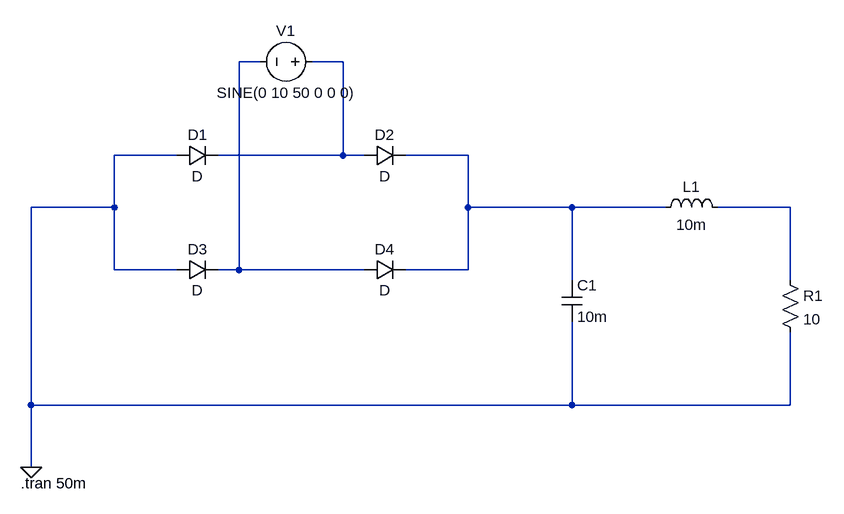
[diagram p0: schematic rectifier_circuit_v2.asc]
rectifier_circuit_v2.asc, the LTspice schematic file:
Version 4.1
SHEET 1 984 680
WIRE 112 -48 80 -48
WIRE 240 -48 192 -48
WIRE -16 96 -112 96
WIRE 240 96 240 -48
WIRE 240 96 48 96
WIRE 272 96 240 96
WIRE 432 96 336 96
WIRE -112 176 -112 96
WIRE -112 176 -240 176
WIRE 432 176 432 96
WIRE 592 176 432 176
WIRE 736 176 592 176
WIRE 928 176 816 176
WIRE -112 272 -112 176
WIRE -16 272 -112 272
WIRE 80 272 80 -48
WIRE 80 272 48 272
WIRE 272 272 80 272
WIRE 432 272 432 176
WIRE 432 272 336 272
WIRE 592 288 592 176
WIRE 928 288 928 176
WIRE -240 480 -240 176
WIRE 592 480 592 352
WIRE 592 480 -240 480
WIRE 928 480 928 368
WIRE 928 480 592 480
WIRE -240 576 -240 480
FLAG -240 576 0
SYMBOL diode -16 112 R270
WINDOW 0 32 32 VTop 2
WINDOW 3 0 32 VBottom 2
SYMATTR InstName D1
SYMBOL diode 272 112 R270
WINDOW 0 32 32 VTop 2
WINDOW 3 0 32 VBottom 2
SYMATTR InstName D2
SYMBOL diode -16 288 R270
WINDOW 0 32 32 VTop 2
WINDOW 3 0 32 VBottom 2
SYMATTR InstName D3
SYMBOL diode 272 288 R270
WINDOW 0 32 32 VTop 2
WINDOW 3 0 32 VBottom 2
SYMATTR InstName D4
SYMBOL voltage 208 -48 R90
WINDOW 0 -32 56 VBottom 2
WINDOW 3 32 56 VTop 2
WINDOW 123 0 0 Left 0
WINDOW 39 0 0 Left 0
SYMATTR InstName V1
SYMATTR Value SINE(0 10 50 0 0 0)
SYMBOL cap 576 288 R0
SYMATTR InstName C1
SYMATTR Value 10m
SYMBOL res 912 272 R0
SYMATTR InstName R1
SYMATTR Value 10
SYMBOL ind 720 192 R270
WINDOW 0 32 56 VTop 2
WINDOW 3 5 56 VBottom 2
SYMATTR InstName L1
SYMATTR Value 10m
TEXT -256 600 Left 2 !.tran 50m

The netlist it stands for:
* rectifier_circuit_v2.asc
D1 0 N002 D
D2 N002 N003 D
D3 0 N001 D
D4 N001 N003 D
V1 N002 N001 SINE(0 10 50 0 0 0)
C1 N003 0 10m
R1 N004 0 10
L1 N003 N004 10m
.model D D
.lib standard.dio
.tran 50m
.backanno
.end